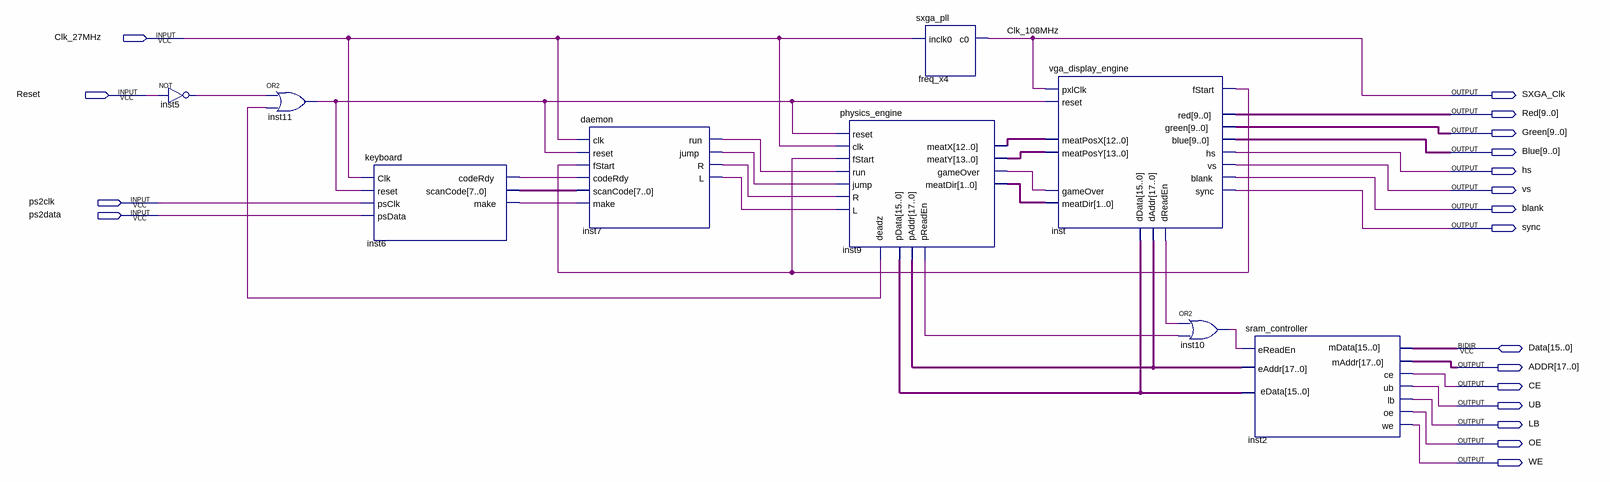
[diagram p0: schematic sheet]
// Quartus schematic Altera_Meatboy_HD.bdf as structural Verilog: 9 symbols, 19 pins
module Altera_Meatboy_HD (
  input  Clk_27MHz,
  input  Reset,
  input  ps2clk,
  input  ps2data,
  inout  [15:0] Data,
  output SXGA_Clk,
  output [9:0] Red,
  output [9:0] Green,
  output [9:0] Blue,
  output hs,
  output vs,
  output blank,
  output sync,
  output [17:0] ADDR,
  output CE,
  output UB,
  output LB,
  output OE,
  output WE
);

  wire inst5_out, inst6_coderdy, inst6_make, inst7_jump, inst7_l, inst7_r, inst7_run, inst9_deadz,
       inst9_gameover, inst9_preaden, inst10_out, inst11_out, inst_dreaden, inst_fstart;
  wire [1:0] inst9_meatdir;
  wire [7:0] inst6_scancode;
  wire [12:0] inst9_meatx;
  wire [13:0] inst9_meaty;
  wire [15:0] inst2_edata;
  wire [17:0] inst9_paddr;

  not inst5 (inst5_out, Reset);
  or inst11 (inst11_out, inst5_out, inst9_deadz);
  keyboard inst6 (
    .Clk(Clk_27MHz), .reset(inst11_out), .psClk(ps2clk), .psData(ps2data), .codeRdy(inst6_coderdy),
    .scanCode(inst6_scancode), .make(inst6_make));
  daemon inst7 (
    .clk(Clk_27MHz), .reset(inst11_out), .fStart(inst_fstart), .codeRdy(inst6_coderdy),
    .scanCode(inst6_scancode), .make(inst6_make), .run(inst7_run), .jump(inst7_jump), .R(inst7_r), .L(inst7_l));
  physics_engine inst9 (
    .reset(inst11_out), .clk(Clk_27MHz), .fStart(inst_fstart), .run(inst7_run), .jump(inst7_jump),
    .R(inst7_r), .L(inst7_l), .pData(inst2_edata), .deadz(inst9_deadz), .meatX(inst9_meatx),
    .meatY(inst9_meaty), .gameOver(inst9_gameover), .meatDir(inst9_meatdir), .pAddr(inst9_paddr),
    .pReadEn(inst9_preaden));
  sxga_pll freq_x4 (.inclk0(Clk_27MHz), .c0(SXGA_Clk));
  vga_display_engine inst (
    .pxlClk(SXGA_Clk), .reset(inst11_out), .meatPosX(inst9_meatx), .meatPosY(inst9_meaty),
    .gameOver(inst9_gameover), .meatDir(inst9_meatdir), .dData(inst2_edata), .fStart(inst_fstart), .red(Red),
    .green(Green), .blue(Blue), .hs(hs), .vs(vs), .blank(blank), .sync(sync), .dAddr(inst9_paddr),
    .dReadEn(inst_dreaden));
  or inst10 (inst10_out, inst_dreaden, inst9_preaden);
  sram_controller inst2 (
    .eReadEn(inst10_out), .eAddr(inst9_paddr), .mData(Data), .eData(inst2_edata), .mAddr(ADDR), .ce(CE),
    .ub(UB), .lb(LB), .oe(OE), .we(WE));

  // Other names for the same wires on the sheet: Clk_108MHz = SXGA_Clk
endmodule
